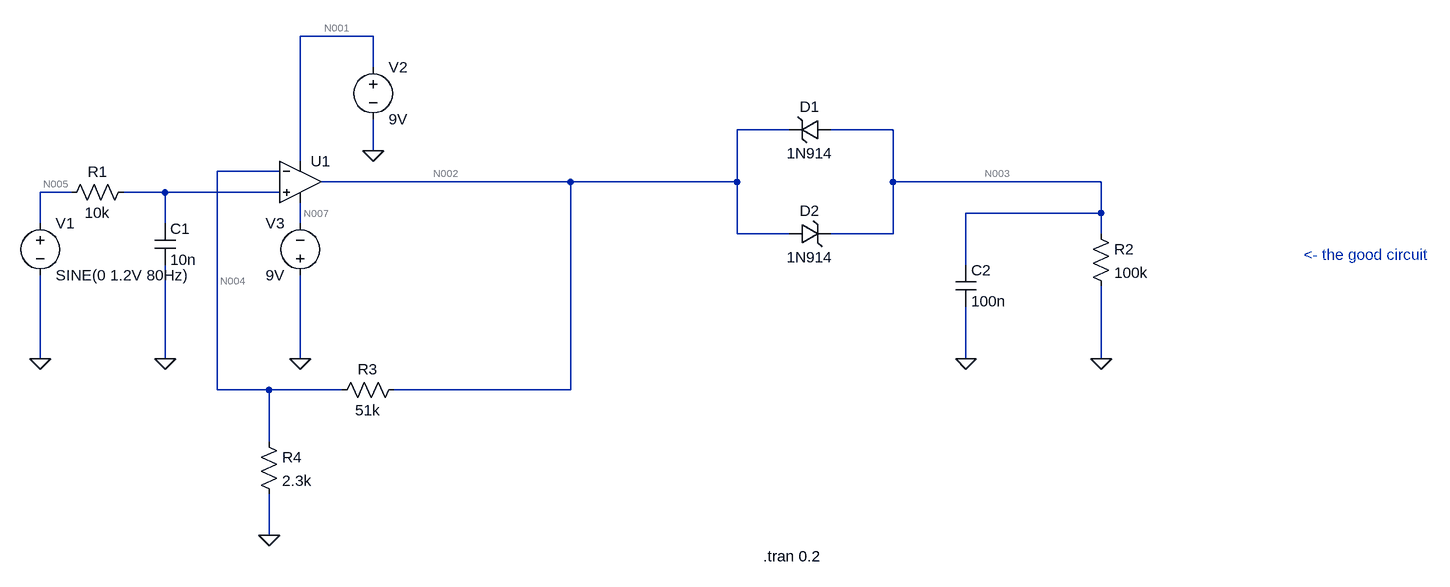
[diagram p0: schematic finalSchematic.asc]
finalSchematic.asc, the LTspice schematic file:
Version 4.1
SHEET 1 2644 680
WIRE 992 -1056 880 -1056
WIRE 992 -1008 992 -1056
WIRE 1632 -912 1552 -912
WIRE 1792 -912 1696 -912
WIRE 992 -880 992 -928
WIRE 880 -864 880 -1056
WIRE 848 -848 752 -848
WIRE 1296 -832 912 -832
WIRE 1552 -832 1552 -912
WIRE 1552 -832 1296 -832
WIRE 1792 -832 1792 -912
WIRE 2112 -832 1792 -832
WIRE 528 -816 480 -816
WIRE 672 -816 608 -816
WIRE 848 -816 672 -816
WIRE 2112 -784 2112 -832
WIRE 2112 -784 1904 -784
WIRE 480 -768 480 -816
WIRE 672 -768 672 -816
WIRE 880 -768 880 -800
WIRE 1552 -752 1552 -832
WIRE 1632 -752 1552 -752
WIRE 1792 -752 1792 -832
WIRE 1792 -752 1696 -752
WIRE 2112 -752 2112 -784
WIRE 1904 -704 1904 -784
WIRE 480 -560 480 -688
WIRE 672 -560 672 -704
WIRE 880 -560 880 -688
WIRE 1904 -560 1904 -640
WIRE 2112 -560 2112 -672
WIRE 752 -512 752 -848
WIRE 832 -512 752 -512
WIRE 944 -512 832 -512
WIRE 1296 -512 1296 -832
WIRE 1296 -512 1024 -512
WIRE 832 -432 832 -512
WIRE 832 -288 832 -352
FLAG 480 -560 0
FLAG 672 -560 0
FLAG 992 -880 0
FLAG 880 -560 0
FLAG 2112 -560 0
FLAG 832 -288 0
FLAG 1904 -560 0
SYMBOL voltage 480 -784 R0
WINDOW 123 0 0 Left 0
WINDOW 39 0 0 Left 0
SYMATTR InstName V1
SYMATTR Value SINE(0 1.2V 80Hz)
SYMBOL cap 656 -768 R0
SYMATTR InstName C1
SYMATTR Value 10n
SYMBOL voltage 992 -1024 R0
SYMATTR InstName V2
SYMATTR Value 9V
SYMBOL voltage 880 -672 R180
WINDOW 0 24 96 Left 2
WINDOW 3 24 16 Left 2
SYMATTR InstName V3
SYMATTR Value 9V
SYMBOL OpAmps\\UniversalOpAmp2 880 -832 R0
SYMATTR InstName U1
SYMBOL res 624 -832 R90
WINDOW 0 0 56 VBottom 2
WINDOW 3 32 56 VTop 2
SYMATTR InstName R1
SYMATTR Value 10k
SYMBOL res 2096 -768 R0
SYMATTR InstName R2
SYMATTR Value 100k
SYMBOL res 1040 -528 R90
WINDOW 0 0 56 VBottom 2
WINDOW 3 32 56 VTop 2
SYMATTR InstName R3
SYMATTR Value 51k
SYMBOL zener 1696 -928 R90
WINDOW 0 -4 32 VBottom 2
WINDOW 3 36 32 VTop 2
SYMATTR InstName D1
SYMATTR Value 1N914
SYMBOL zener 1632 -736 R270
WINDOW 0 36 32 VTop 2
WINDOW 3 -4 32 VBottom 2
SYMATTR InstName D2
SYMATTR Value 1N914
SYMBOL res 816 -448 R0
SYMATTR InstName R4
SYMATTR Value 2.3k
SYMBOL cap 1888 -704 R0
SYMATTR InstName C2
SYMATTR Value 100n
TEXT 2424 -720 Left 2 ;<- the good circuit
TEXT 1592 -256 Left 2 !.tran 0.2

The netlist it stands for:
* finalSchematic.asc
V1 N005 0 SINE(0 1.2V 80Hz)
C1 N006 0 10n
V2 N001 0 9V
V3 0 N007 9V
X§U1 N006 N004 N001 N007 N002 level2 Avol=1Meg GBW=10Meg Slew=10Meg Ilimit=25m Rail=0 Vos=0 En=0 Enk=0 In=0 Ink=0 Rin=500Meg  ; pins In+ In- V+ V- OUT
R1 N006 N005 10k
R2 N003 0 100k
R3 N002 N004 51k
D1 N003 N002 1N914
D2 N002 N003 1N914
R4 N004 0 2.3k
C2 N003 0 100n
.model D D
.lib standard.dio
* <- the good circuit
.tran 0.2
.lib UniversalOpAmp2.lib
.backanno
.end

* Results of the author's LTspice run, read from the files saved beside the schematic
* Operating Point, zero values left out:
*   V(n001) = 9 V
*   V(n007) = -9 V
*   I(V2) = -899.7 µA
*   I(V3) = -899.7 µA
*   Ix(u1:3) = 899.7 µA
*   Ix(u1:4) = -899.7 µA
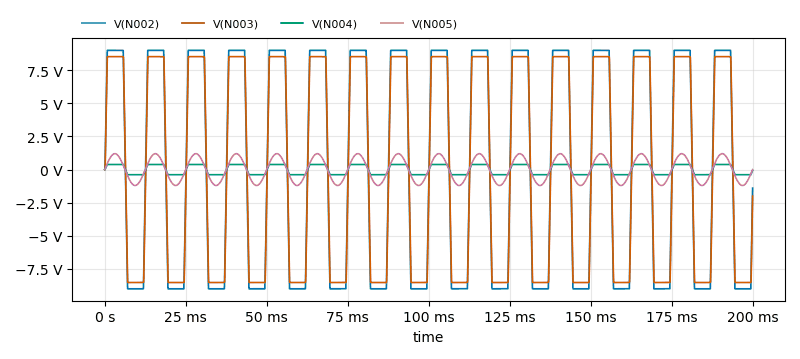
[diagram p1: Transient Analysis of finalSchematic.asc, plotted from the saved traces]
* Transient Analysis, 1 run:
*   V(N002): min -8.997 V, max 8.997 V, average 669.1 µV, rms 8.359 V, last -1.4 V
*   V(N003): min -8.525 V, max 8.525 V, average 897 µV, rms 7.954 V, last -2 V
*   V(N004): min -388.3 mV, max 388.3 mV, average 28.87 µV, rms 360.7 mV, last -60.42 mV
*   V(N005): min -1.2 V, max 1.2 V, average -386.9 nV, rms 848.4 mV, last 0 V